# EAGLE design awg-buffer-mod1 (EAGLE 7.7.0)
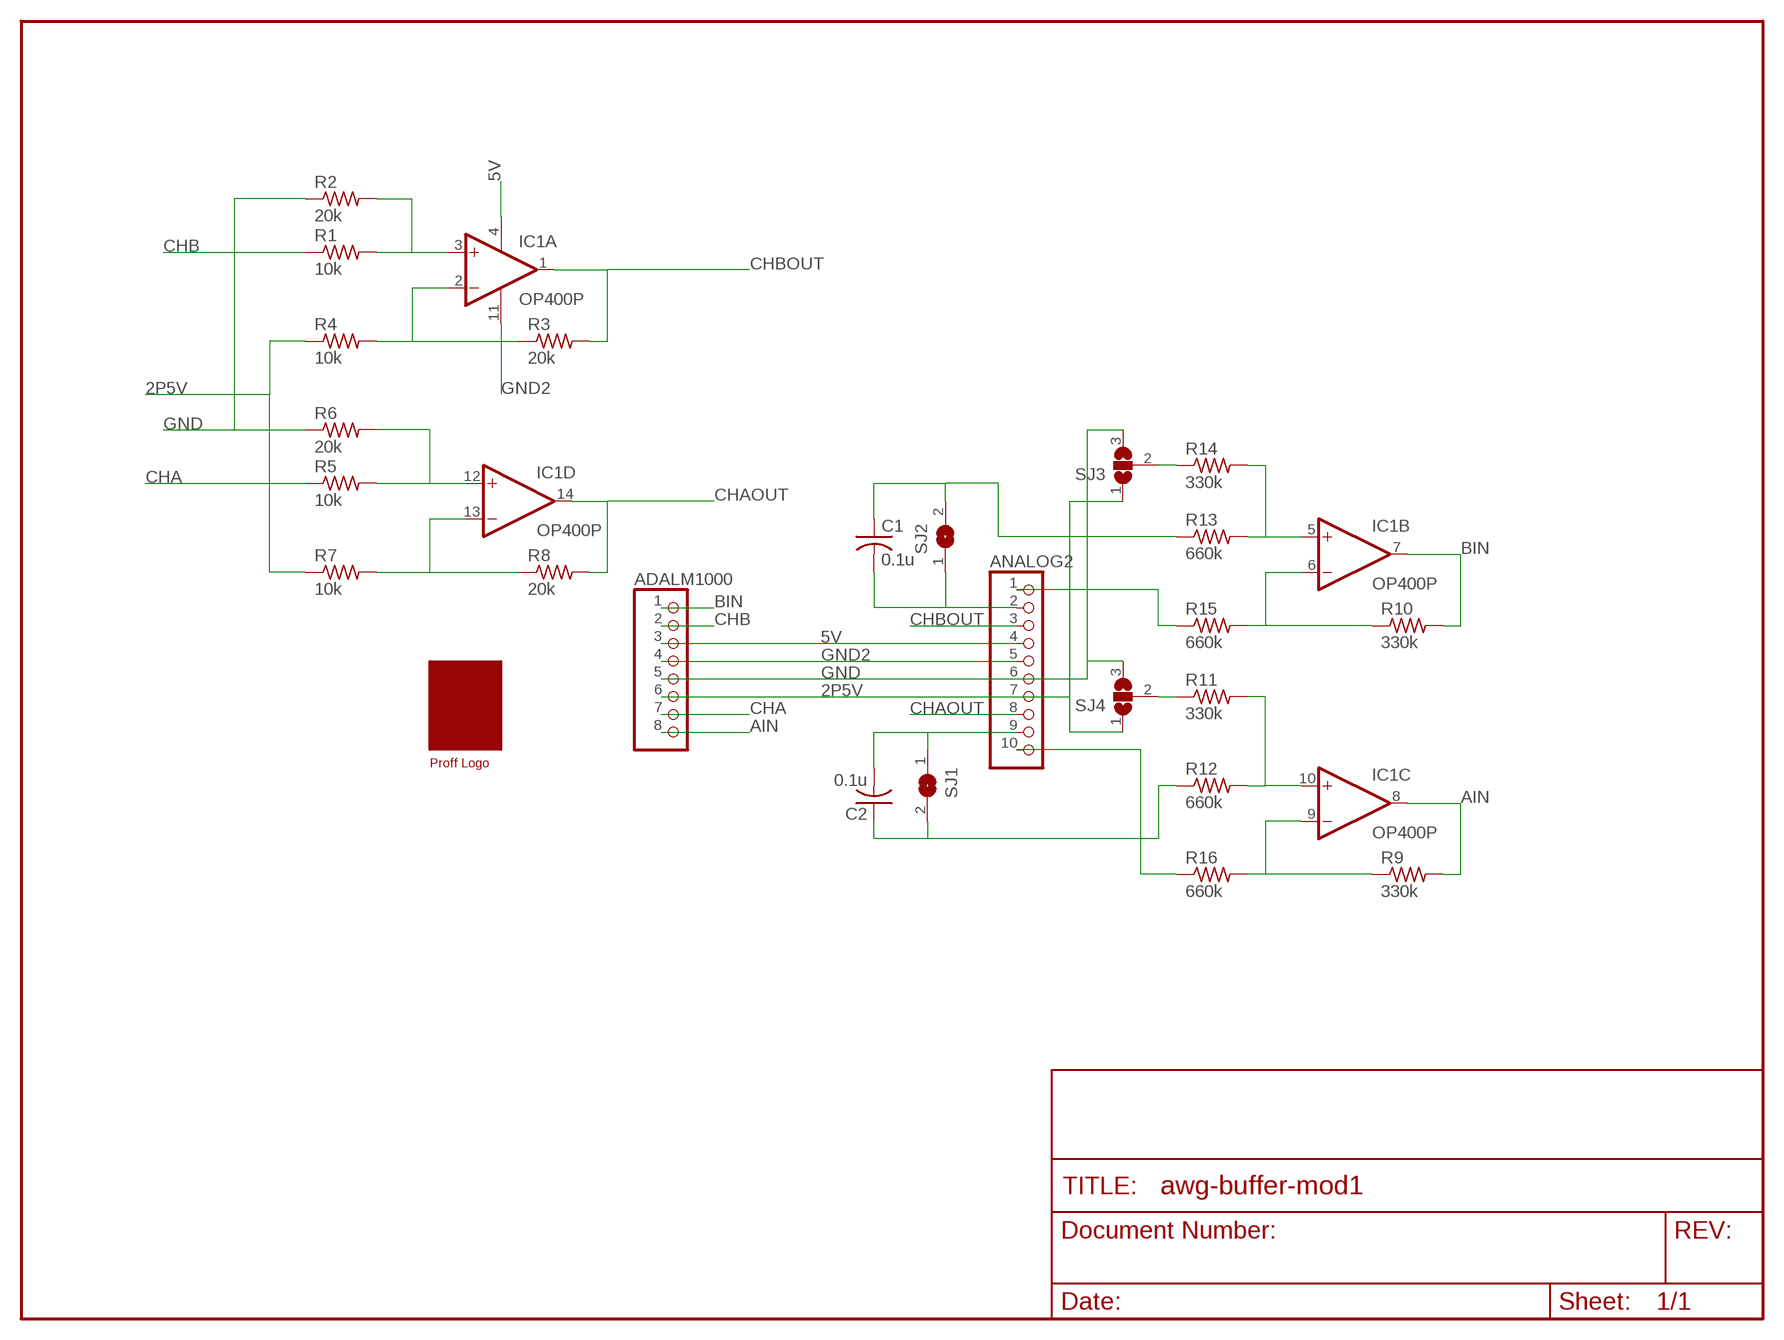
[diagram p0: schematic, sheet 1]

## Parts
ADALM1000  PINHD-1X8  [1X08]
ANALOG2  PINHD-1X10  [1X10]
C1  0.1u  C-US050-024X044  [C050-024X044]
C2  0.1u  C-US050-024X044  [C050-024X044]
IC1  OP400P  [DIL14]
R1  10k  R-US_0204/7  [0204/7]
R2  20k  R-US_0204/7  [0204/7]
R3  20k  R-US_0204/7  [0204/7]
R4  10k  R-US_0204/7  [0204/7]
R5  10k  R-US_0204/7  [0204/7]
R6  20k  R-US_0204/7  [0204/7]
R7  10k  R-US_0204/7  [0204/7]
R8  20k  R-US_0204/7  [0204/7]
R9  330k  R-US_0204/7  [0204/7]
R10  330k  R-US_0204/7  [0204/7]
R11  330k  R-US_0204/7  [0204/7]
R12  660k  R-US_0204/7  [0204/7]
R13  660k  R-US_0204/7  [0204/7]
R14  330k  R-US_0204/7  [0204/7]
R15  660k  R-US_0204/7  [0204/7]
R16  660k  R-US_0204/7  [0204/7]
SJ1  SJ  [SJ]
SJ2  SJ  [SJ]
SJ3  SJ2W  [SJ_2]
SJ4  SJ2W  [SJ_2]
U$1  PROFF  [PROFF]

## Nets
2P5V: ADALM1000.6 ANALOG2.7 R4.1 R7.1 SJ3.1 SJ4.1
5V: ADALM1000.3 ANALOG2.4 IC1.4(P:V+)
AIN: ADALM1000.8 IC1.8(C:OUT) R9.2
BIN: ADALM1000.1 IC1.7(B:OUT) R10.2
CHA: ADALM1000.7 R5.1
CHAOUT: ANALOG2.8 IC1.14(D:OUT) R8.2
CHB: ADALM1000.2 R1.1
CHBOUT: ANALOG2.3 IC1.1(A:OUT) R3.2
GND: ADALM1000.5 ANALOG2.6 R2.1 R6.1 SJ3.3 SJ4.3
GND2: ADALM1000.4 ANALOG2.5 IC1.11(P:V-)
N$1: ANALOG2.2 C1.2 SJ2.1
N$2: IC1.10(C:+IN) R11.2 R12.2
N$3: ANALOG2.9 C2.2 SJ1.1
N$4: IC1.9(C:-IN) R9.1 R16.2
N$5: C2.1 R12.1 SJ1.2
N$6: C1.1 R13.1 SJ2.2
N$7: IC1.6(B:-IN) R10.1 R15.2
N$8: IC1.2(A:-IN) R3.1 R4.2
N$9: IC1.13(D:-IN) R7.2 R8.1
N$10: IC1.3(A:+IN) R1.2 R2.2
N$11: IC1.12(D:+IN) R5.2 R6.2
N$12: IC1.5(B:+IN) R13.2 R14.2
N$13: ANALOG2.1 R15.1
N$16: ANALOG2.10 R16.1
N$17: R14.1 SJ3.2
N$18: R11.1 SJ4.2

## Library data of the parts
ADALM1000 = pinhead:PINHD-1X8: PIN HEADER
ANALOG2 = pinhead:PINHD-1X10: PIN HEADER
C1 C2 = rcl:C-US: CAPACITOR, American symbol
IC1 = linear:OP400: OP AMP
R1-R16 = resistor:R-US_: RESISTOR, American symbol
SJ1 SJ2 = jumper:SJ: SMD solder JUMPER
SJ3 SJ4 = jumper:SJ2W: SMD solder JUMPER
U$1 = logo:PROFF

## Board
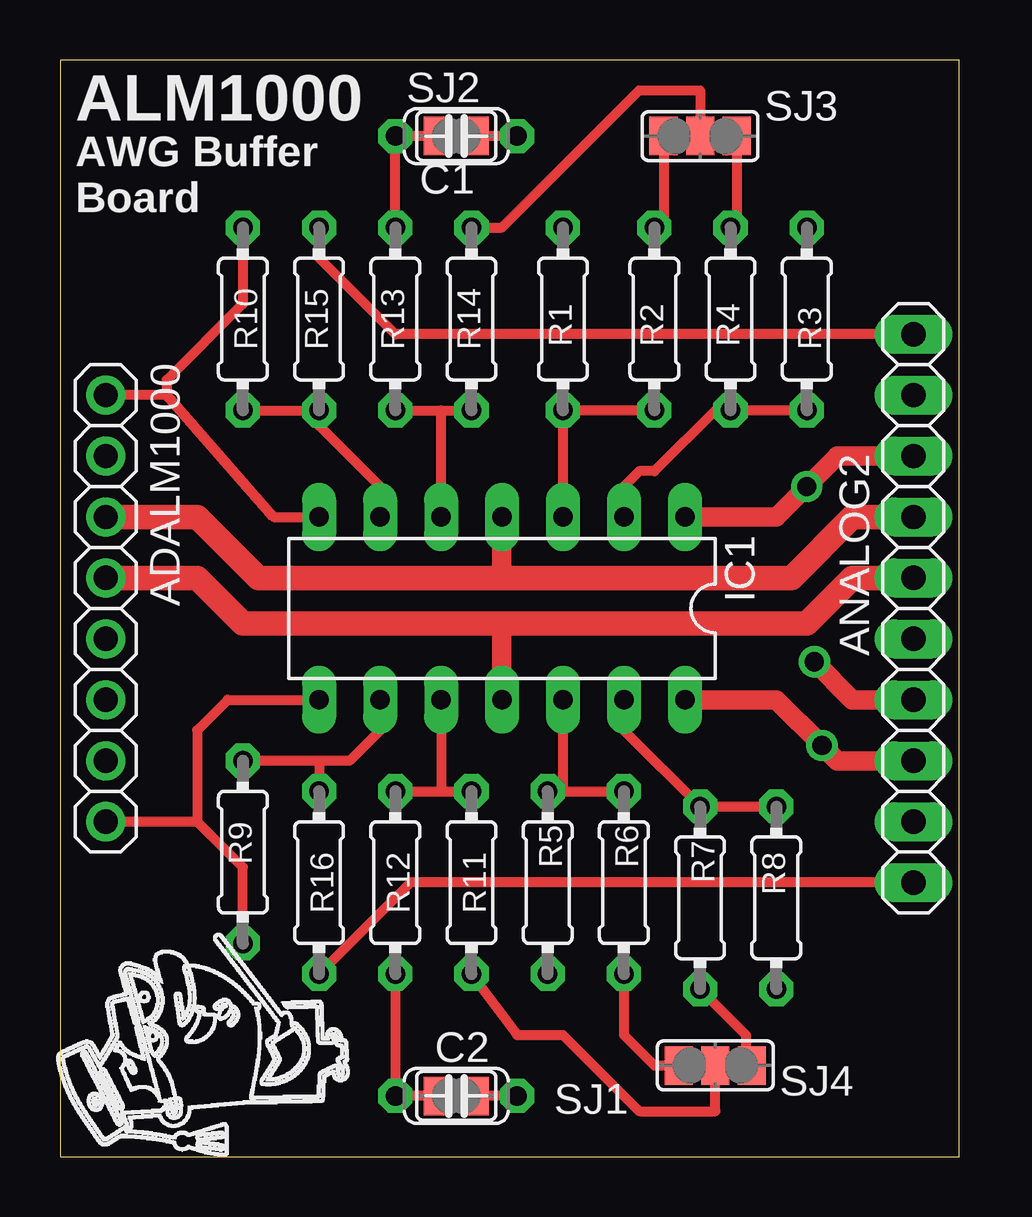
[diagram p1: board, top side]
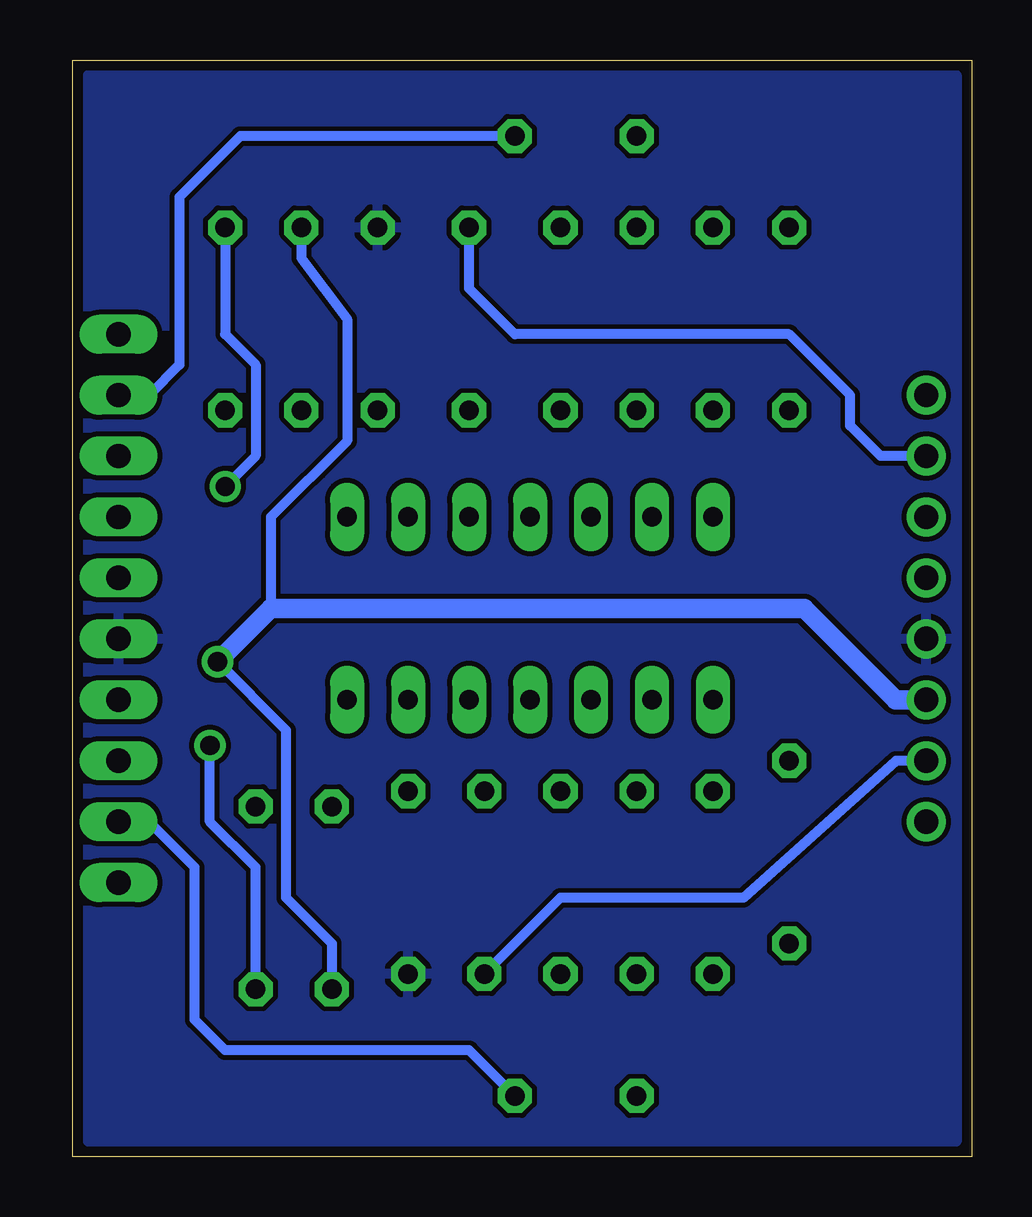
[diagram p2: board, bottom side, seen from below]

Size 37.47 x 45.72 mm. Coordinates in mm from the lower left corner, seen from the top.
Outline: 37.47,0 37.47,45.72 0,45.72 0,0 37.47,0
Copper layers (1*16): Top 0.035mm / dielectric 1.5mm / Bottom 0.035mm
Design rules "default": minimum track width 8mil, minimum drill 20mil, track to track 8mil, track to pad 8mil, pad to pad 8mil, via to via 8mil, smd to smd 8mil, copper to edge 8mil, drill to drill 8mil, minimum pad ring 12mil, minimum via ring 10mil, stop-mask expansion 4mil, vias tented up to drill 20mil, thermal gap 10mil

### Footprints (pad centres in the part's own frame; a part is rotated, then mirrored left to right if it is on the bottom)
1X08 = drill 1.016: 1 -8.89,0; 2 -6.35,0; 3 -3.81,0; 4 -1.27,0; 5 1.27,0; 6 3.81,0; 7 6.35,0; 8 8.89,0
1X10 = drill 1.016 long: 1 -11.43,0; 2 -8.89,0; 3 -6.35,0; 4 -3.81,0; 5 -1.27,0; 6 1.27,0; 7 3.81,0; 8 6.35,0; 9 8.89,0; 10 11.43,0
C050-024X044 = drill 0.813 octagon: 1 -2.54,0; 2 2.54,0
DIL14 = drill 0.813 long: 1 -7.62,-3.81; 2 -5.08,-3.81; 3 -2.54,-3.81; 4 0,-3.81; 5 2.54,-3.81; 6 5.08,-3.81; 7 7.62,-3.81; 8 7.62,3.81; 9 5.08,3.81; 10 2.54,3.81; 11 0,3.81; 12 -2.54,3.81; 13 -5.08,3.81; 14 -7.62,3.81
0204/7 = drill 0.813 octagon: 1 -3.81,0; 2 3.81,0
SJ = smd 1.168 x 1.6: 1 -0.762,0; 2 0.762,0
SJ_2 = smd 1.168 x 1.6: 1 -1.524,0; 2 0,0; 3 1.524,0

### Placement (x,y rotation side)
ADALM1000  1.91,22.86 270 top
ANALOG2  35.56,22.86 270 top
C1  16.51,42.55 0 top
C2  16.51,2.54 0 top
IC1  18.41,22.86 180 top
R1  20.95,34.92 270 top
R2  24.76,34.92 270 top
R3  31.11,34.92 90 top
R4  27.94,34.92 270 top
R5  20.32,11.43 90 top
R6  23.49,11.43 90 top
R7  26.67,10.79 90 top
R8  29.84,10.79 270 top
R9  7.62,12.7 270 top
R10  7.62,34.92 90 top
R11  17.14,11.43 90 top
R12  13.97,11.43 90 top
R13  13.97,34.92 270 top
R14  17.14,34.92 270 top
R15  10.79,34.92 270 top
R16  10.79,11.43 90 top
SJ1  16.51,2.54 180 top
SJ2  16.51,42.55 180 top
SJ3  26.67,42.55 180 top
SJ4  27.3,3.81 180 top
U$1  12.06,0 90 top

### Tracks (layer width: path | path; a pad name or v marks a point on that pad's centre or on a via)
2P5V  (via drill 0.8)
  Top 0.406: SJ3.1 28.19,38.99 R4.1 | R7.1 28.57,5.08 28.57,4.06 SJ4.1
  Top 0.813: ANALOG2.7 33.02,19.05 v31.43,20.64
  Bottom 0.406: R7.1 26.67,8.89 28.57,10.79 28.57,17.78 v31.43,20.64 | R4.1 27.94,37.47 26.04,34.92 26.04,29.84 29.21,26.67 29.21,22.86
  Bottom 0.813: ADALM1000.6 3.17,19.05 6.99,22.86 29.21,22.86 v31.43,20.64
5V
  Top 0.813: IC1.4 18.41,24.13
  Top 1.016: ADALM1000.3 5.71,26.67 8.26,24.13 18.41,24.13 30.48,24.13 33.02,26.67 ANALOG2.4
AIN
  Top 0.406: 5.71,13.97 5.71,17.78 6.99,19.05 IC1.8 | 5.71,13.97 ADALM1000.8 | R9.2 7.62,12.06 5.71,13.97
BIN
  Top 0.406: R10.2 7.62,35.56 4.45,32.38 4.45,31.75 | 4.45,31.75 ADALM1000.1 | 4.45,31.75 8.89,26.67 IC1.7
CHA
  Bottom 0.406: ADALM1000.7 3.17,16.51 9.53,10.79 17.14,10.79 R5.1
CHAOUT  (via drill 0.8)
  Top 0.813: ANALOG2.8 32.39,16.51 v31.75,17.14 29.84,19.05 IC1.14
  Bottom 0.406: R8.2 29.84,12.06 31.75,13.97 v31.75,17.14
CHB
  Bottom 0.406: ADALM1000.2 3.81,29.21 5.08,30.48 5.08,31.75 7.62,34.29 19.05,34.29 20.95,36.2 R1.1
CHBOUT  (via drill 0.8)
  Top 0.813: ANALOG2.3 32.39,29.21 v31.11,27.94 29.84,26.67 IC1.1
  Bottom 0.406: R3.2 31.11,34.29 29.84,33.02 29.84,29.21 v31.11,27.94
GND
  Top 0.406: SJ3.3 25.15,39.12 R2.1 | R6.1 23.49,5.08 24.76,3.81 SJ4.3
  pour Bottom: 0.64,0.64 36.83,0.64 36.83,45.09 0.64,45.09
GND2
  Top 0.813: IC1.11 18.41,22.23
  Top 1.016: ADALM1000.4 5.71,24.13 7.62,22.23 18.41,22.23 31.11,22.23 33.02,24.13 ANALOG2.5
N$1
  Top 0.406: C1.2 SJ2.1
  Bottom 0.406: C1.2 30.48,42.55 33.02,40.01 33.02,33.02 34.29,31.75 ANALOG2.2
N$2
  Top 0.406: R12.2 15.88,15.24 | 15.88,15.24 R11.2 | IC1.10 15.88,15.24
N$3
  Top 0.406: C2.2 SJ1.1
  Bottom 0.406: C2.2 20.95,4.45 31.11,4.45 32.39,5.71 32.39,12.06 34.29,13.97 ANALOG2.9
N$4
  Top 0.406: 10.79,16.51 R9.1 | 10.79,16.51 12.06,16.51 13.34,17.78 IC1.9 | 10.79,16.51 R16.2
N$5
  Top 0.406: SJ1.2 C2.1 R12.1
N$6
  Top 0.406: SJ2.2 C1.1 R13.1
N$7
  Top 0.406: R10.1 R15.2 10.79,30.48 13.34,27.94 IC1.6
N$8
  Top 0.406: R3.1 R4.2 27.3,31.11 24.76,28.57 24.13,28.57 23.49,27.94 IC1.2
N$9
  Top 0.406: R8.1 R7.2 23.49,17.78 IC1.13
N$10
  Top 0.406: R2.2 R1.2 IC1.3
N$11
  Top 0.406: R5.2 20.95,15.24 | 20.95,15.24 R6.2 | IC1.12 20.95,15.24
N$12
  Top 0.406: R13.2 15.88,31.11 | 15.88,31.11 R14.2 | IC1.5 15.88,31.11
N$13
  Top 0.406: ANALOG2.1 13.97,34.29 10.79,37.47 R15.1
N$16
  Top 0.406: ANALOG2.10 14.61,11.43 R16.1
N$17
  Top 0.406: R14.1 18.41,38.73 24.13,44.45 26.67,44.45 SJ3.2
N$18
  Top 0.406: R11.1 19.05,5.08 20.95,5.08 24.13,1.91 27.3,1.91 SJ4.2

### Text on the board
tPlace: ALM1000 | AWG Buffer / Board